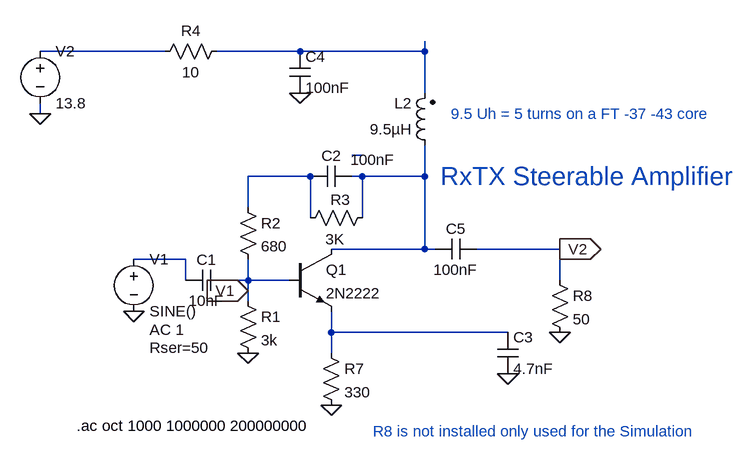
[diagram p0: schematic P3ST_RF_AMP.asc]
P3ST_RF_AMP.asc, the LTspice schematic file:
Version 4
SHEET 1 1040 680
WIRE -48 -144 -240 -144
WIRE 160 -144 32 -144
WIRE 352 -144 352 -160
WIRE 352 -144 160 -144
WIRE 352 -80 352 -144
WIRE -240 -48 -240 -64
WIRE 256 16 240 16
WIRE 176 48 80 48
WIRE 256 48 240 48
WIRE 352 48 352 0
WIRE 352 48 256 48
WIRE 80 96 80 48
WIRE 176 112 176 48
WIRE 256 112 256 48
WIRE 352 160 352 48
WIRE 352 160 208 160
WIRE 368 160 352 160
WIRE 560 160 432 160
WIRE -16 176 -96 176
WIRE -16 208 -16 176
WIRE 80 208 80 176
WIRE 80 208 48 208
WIRE 144 208 80 208
WIRE 560 208 560 160
WIRE 80 224 80 208
WIRE 80 240 80 224
WIRE 208 288 208 256
WIRE 480 288 208 288
WIRE 208 320 208 288
FLAG -96 256 0
FLAG 80 320 0
FLAG 208 400 0
FLAG -240 -48 0
FLAG 160 -80 0
FLAG 560 288 0
FLAG 480 352 0
FLAG 560 160 V2
IOPIN 560 160 Out
FLAG 80 224 V1
IOPIN 80 224 In
SYMBOL cap 48 192 R90
WINDOW 0 0 32 VBottom 2
WINDOW 3 32 32 VTop 2
SYMATTR InstName C1
SYMATTR Value 10nF
SYMBOL voltage -96 160 R0
WINDOW 123 24 124 Left 2
WINDOW 39 24 152 Left 2
SYMATTR Value2 AC 1
SYMATTR SpiceLine Rser=50
SYMATTR InstName V1
SYMATTR Value SINE()
SYMBOL res 64 224 R0
SYMATTR InstName R1
SYMATTR Value 3k
SYMBOL res 272 96 R90
WINDOW 0 4 50 VBottom 2
WINDOW 3 33 58 VTop 2
SYMATTR InstName R3
SYMATTR Value 3K
SYMBOL ind2 368 16 R180
WINDOW 0 36 80 Left 2
WINDOW 3 36 40 Left 2
SYMATTR InstName L2
SYMATTR Value 9.5µH
SYMATTR Type ind
SYMBOL npn2 144 160 R0
SYMATTR InstName Q1
SYMATTR Value 2N2222
SYMBOL res 192 304 R0
SYMATTR InstName R7
SYMATTR Value 330
SYMBOL voltage -240 -160 R0
WINDOW 123 0 0 Left 2
WINDOW 39 0 0 Left 2
SYMATTR InstName V2
SYMATTR Value 13.8
SYMBOL cap 144 -144 R0
SYMATTR InstName C4
SYMATTR Value 100nF
SYMBOL cap 432 144 R90
WINDOW 0 0 32 VBottom 2
WINDOW 3 32 32 VTop 2
SYMATTR InstName C5
SYMATTR Value 100nF
SYMBOL res 544 192 R0
SYMATTR InstName R8
SYMATTR Value 50
SYMBOL res 48 -160 R90
WINDOW 0 0 56 VBottom 2
WINDOW 3 32 56 VTop 2
SYMATTR InstName R4
SYMATTR Value 10
SYMBOL cap 464 288 R0
SYMATTR InstName C3
SYMATTR Value 4.7nF
SYMBOL cap 240 32 R90
WINDOW 0 0 32 VBottom 2
WINDOW 3 -25 -32 VTop 2
SYMATTR InstName C2
SYMATTR Value 100nF
SYMBOL res 64 80 R0
SYMATTR InstName R2
SYMATTR Value 680
TEXT -184 432 Left 2 !.ac oct 1000 1000000 200000000
TEXT 392 -48 Left 2 ;9.5 Uh = 5 turns on a FT -37 -43 core
TEXT 376 48 Left 4 ;RxTX Steerable Amplifier
TEXT 272 440 Left 2 ;R8 is not installed only used for the Simulation

The netlist it stands for:
* P3ST_RF_AMP.asc
C1 V1 N006 10nF
V1 N006 0 SINE() AC 1 Rser=50
R1 V1 0 3k
R3 N005 N004 3K
L2 N005 N002 9.5µH
Q1 N005 V1 N007 0 2N2222
R7 N007 0 330
V2 N001 0 13.8
C4 N002 0 100nF
C5 V2 N005 100nF
R8 V2 0 50
R4 N002 N001 10
C3 N007 0 4.7nF
C2 N005 N004 100nF
R2 N004 V1 680
.model NPN NPN
.model PNP PNP
.lib standard.bjt
.ac oct 1000 1000000 200000000
* 9.5 Uh = 5 turns on a FT -37 -43 core
* RxTX Steerable Amplifier
* R8 is not installed only used for the Simulation
.backanno
.end